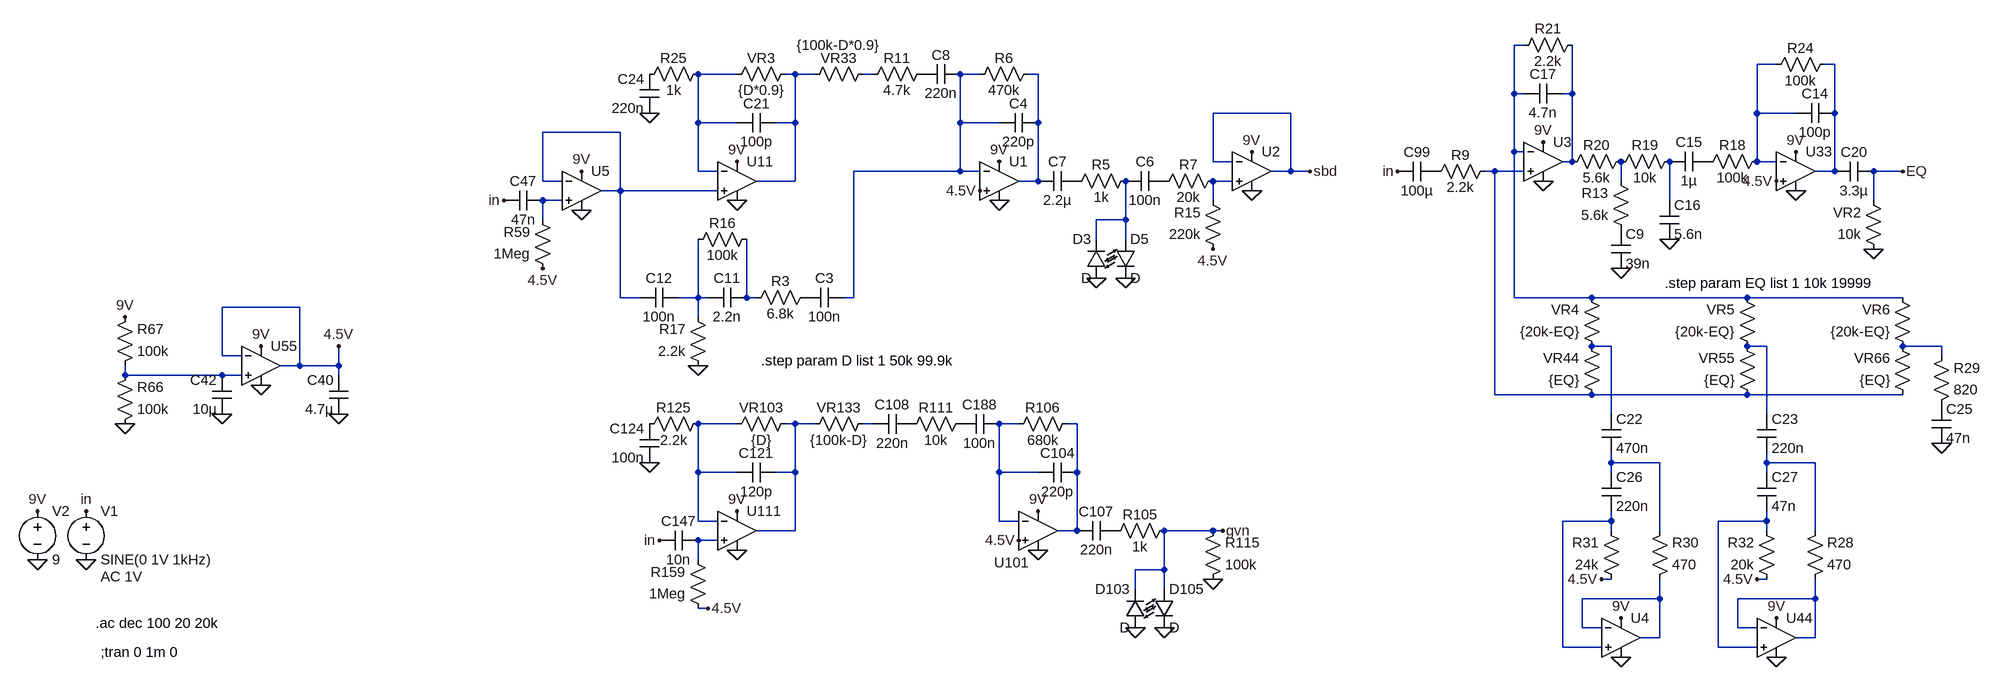
[diagram p0: schematic SuperBadassDist.asc]
SuperBadassDist.asc, the LTspice schematic file:
Version 4
SHEET 1 3148 2436
WIRE -80 0 -96 0
WIRE 336 32 304 32
WIRE 432 32 416 32
WIRE -1376 48 -1440 48
WIRE -1280 48 -1296 48
WIRE -1248 48 -1280 48
WIRE -1152 48 -1168 48
WIRE -976 48 -1008 48
WIRE -880 48 -896 48
WIRE -96 80 -96 0
WIRE -80 80 -96 80
WIRE 0 80 0 0
WIRE 0 80 -16 80
WIRE -464 112 -592 112
WIRE 304 112 304 32
WIRE 368 112 304 112
WIRE 432 112 432 32
WIRE -1440 128 -1440 48
WIRE -1376 128 -1440 128
WIRE -1280 128 -1280 48
WIRE -1280 128 -1312 128
WIRE -1008 128 -1008 48
WIRE -944 128 -1008 128
WIRE -880 128 -880 48
WIRE -1568 144 -1696 144
WIRE -96 176 -96 80
WIRE -80 176 -96 176
WIRE -592 192 -592 112
WIRE -560 192 -592 192
WIRE 0 192 0 80
WIRE 0 192 -16 192
WIRE 304 192 304 112
WIRE 336 192 304 192
WIRE -1440 208 -1440 128
WIRE -1408 208 -1440 208
WIRE -1008 208 -1008 128
WIRE -1008 208 -1184 208
WIRE -976 208 -1008 208
WIRE -464 208 -464 112
WIRE -464 208 -496 208
WIRE -432 208 -464 208
WIRE -128 208 -144 208
WIRE -80 208 -128 208
WIRE 432 208 432 112
WIRE 432 208 400 208
WIRE 544 208 496 208
WIRE -1696 224 -1696 144
WIRE -1664 224 -1696 224
WIRE -1280 224 -1280 128
WIRE -1280 224 -1344 224
WIRE -880 224 -880 128
WIRE -880 224 -912 224
WIRE -560 224 -592 224
WIRE 80 224 80 192
WIRE -1568 240 -1568 144
WIRE -1568 240 -1600 240
WIRE -1408 240 -1568 240
WIRE -1664 256 -1696 256
WIRE -592 256 -592 224
WIRE 160 256 160 192
WIRE 496 256 496 208
WIRE -1696 288 -1696 256
WIRE -736 288 -736 224
WIRE -736 288 -784 288
WIRE -784 320 -784 288
WIRE -736 320 -736 288
WIRE -1568 416 -1568 240
WIRE -1536 416 -1568 416
WIRE -1440 416 -1440 320
WIRE -1440 416 -1472 416
WIRE -1424 416 -1440 416
WIRE -1360 416 -1360 320
WIRE -1344 416 -1360 416
WIRE -1184 416 -1184 208
WIRE -1184 416 -1200 416
WIRE -96 416 -96 176
WIRE 32 416 -96 416
WIRE 288 416 32 416
WIRE 544 416 288 416
WIRE -2096 432 -2224 432
WIRE -1440 448 -1440 416
WIRE 64 496 32 496
WIRE 320 496 288 496
WIRE 608 496 544 496
WIRE -2224 512 -2224 432
WIRE -2192 512 -2224 512
WIRE 608 512 608 496
WIRE -2096 528 -2096 432
WIRE -2096 528 -2128 528
WIRE -2032 528 -2032 496
WIRE -2032 528 -2096 528
WIRE -2384 544 -2384 528
WIRE -2224 544 -2384 544
WIRE -2192 544 -2224 544
WIRE -2032 544 -2032 528
WIRE -128 576 -128 208
WIRE 32 576 -128 576
WIRE 288 576 32 576
WIRE 544 576 288 576
WIRE 64 608 64 496
WIRE 320 608 320 496
WIRE -1376 624 -1440 624
WIRE -1280 624 -1296 624
WIRE -1248 624 -1280 624
WIRE -1152 624 -1168 624
WIRE -912 624 -944 624
WIRE -816 624 -832 624
WIRE 64 688 64 672
WIRE 144 688 64 688
WIRE 320 688 320 672
WIRE 400 688 320 688
WIRE -1440 704 -1440 624
WIRE -1376 704 -1440 704
WIRE -1280 704 -1280 624
WIRE -1280 704 -1312 704
WIRE -944 704 -944 624
WIRE -880 704 -944 704
WIRE -816 704 -816 624
WIRE 64 704 64 688
WIRE 320 704 320 688
WIRE -1440 784 -1440 704
WIRE -1408 784 -1440 784
WIRE -944 784 -944 704
WIRE -912 784 -944 784
WIRE 64 784 64 768
WIRE 64 784 -16 784
WIRE 320 784 320 768
WIRE 320 784 240 784
WIRE -1280 800 -1280 704
WIRE -1280 800 -1344 800
WIRE -816 800 -816 704
WIRE -816 800 -848 800
WIRE -592 800 -672 800
WIRE -576 800 -592 800
WIRE 64 800 64 784
WIRE 144 800 144 688
WIRE 320 800 320 784
WIRE 400 800 400 688
WIRE -1408 816 -1440 816
WIRE -1440 848 -1440 816
WIRE -672 864 -672 800
WIRE -672 864 -720 864
WIRE 64 880 48 880
WIRE 320 880 304 880
WIRE -720 896 -720 864
WIRE -672 896 -672 864
WIRE 144 912 144 880
WIRE 144 912 16 912
WIRE 400 912 400 880
WIRE 400 912 272 912
WIRE -1424 928 -1440 928
WIRE 16 960 16 912
WIRE 48 960 16 960
WIRE 272 960 272 912
WIRE 304 960 272 960
WIRE 144 976 144 912
WIRE 144 976 112 976
WIRE 400 976 400 912
WIRE 400 976 368 976
WIRE -16 992 -16 784
WIRE 48 992 -16 992
WIRE 240 992 240 784
WIRE 304 992 240 992
FLAG -2448 848 0
FLAG -2448 768 in
FLAG -432 208 sbd
FLAG -2384 448 9V
FLAG -2384 624 0
FLAG -2224 608 0
FLAG -2160 560 0
FLAG -2160 496 9V
FLAG -2032 608 0
FLAG -2032 496 4.5V
FLAG -2528 848 0
FLAG -2528 768 9V
FLAG -1632 272 0
FLAG -1632 208 9V
FLAG -1696 368 4.5V
FLAG -1760 256 in
FLAG -1376 256 0
FLAG -1376 192 9V
FLAG -944 256 0
FLAG -944 192 9V
FLAG -1520 112 0
FLAG -976 240 4.5V
FLAG -1440 528 0
FLAG -784 384 0
FLAG -736 384 0
FLAG -592 336 4.5V
FLAG -528 240 0
FLAG -528 176 9V
FLAG -48 224 0
FLAG -48 160 9V
FLAG 80 1008 0
FLAG 80 944 9V
FLAG 80 368 0
FLAG 160 320 0
FLAG 368 240 0
FLAG 368 176 9V
FLAG 336 224 4.5V
FLAG 496 336 0
FLAG 48 880 4.5V
FLAG 336 1008 0
FLAG 336 944 9V
FLAG 304 880 4.5V
FLAG 608 656 0
FLAG 544 208 EQ
FLAG -288 208 in
FLAG -1424 928 4.5V
FLAG -1504 816 in
FLAG -1376 832 0
FLAG -1376 768 9V
FLAG -880 832 0
FLAG -880 768 9V
FLAG -1520 688 0
FLAG -912 816 4.5V
FLAG -576 800 gvn
FLAG -720 960 0
FLAG -672 960 0
FLAG -592 880 0
SYMBOL voltage -2448 752 R0
WINDOW 123 24 124 Left 2
WINDOW 39 0 0 Left 2
SYMATTR Value2 AC 1V
SYMATTR InstName V1
SYMATTR Value SINE(0 1V 1kHz)
SYMBOL res -2400 544 M180
WINDOW 0 36 76 Left 2
WINDOW 3 36 40 Left 2
SYMATTR InstName R67
SYMATTR Value 100k
SYMBOL res -2400 640 M180
WINDOW 0 36 76 Left 2
WINDOW 3 36 40 Left 2
SYMATTR InstName R66
SYMATTR Value 100k
SYMBOL cap -2208 608 R180
WINDOW 0 24 56 Left 2
WINDOW 3 24 8 Left 2
SYMATTR InstName C42
SYMATTR Value 10µ
SYMBOL Opamps\\UniversalOpamp2 -2160 528 R0
SYMATTR InstName U55
SYMBOL cap -2016 608 R180
WINDOW 0 24 56 Left 2
WINDOW 3 24 8 Left 2
SYMATTR InstName C40
SYMATTR Value 4.7µ
SYMBOL voltage -2528 752 R0
WINDOW 123 0 0 Left 0
WINDOW 39 0 0 Left 0
SYMATTR InstName V2
SYMATTR Value 9
SYMBOL Opamps\\UniversalOpamp2 -1632 240 R0
SYMATTR InstName U5
SYMBOL res -1680 384 R180
WINDOW 0 36 76 Left 2
WINDOW 3 36 40 Left 2
SYMATTR InstName R59
SYMATTR Value 1Meg
SYMBOL cap -1696 240 R90
WINDOW 0 0 32 VBottom 2
WINDOW 3 32 32 VTop 2
SYMATTR InstName C47
SYMATTR Value 47n
SYMBOL Opamps\\UniversalOpamp2 -1376 224 R0
SYMATTR InstName U11
SYMBOL cap -1472 400 R90
WINDOW 0 0 32 VBottom 2
WINDOW 3 32 32 VTop 2
SYMATTR InstName C12
SYMATTR Value 100n
SYMBOL res -1344 304 R90
WINDOW 0 5 56 VBottom 2
WINDOW 3 27 56 VTop 2
SYMATTR InstName R16
SYMATTR Value 100k
SYMBOL cap -1360 400 R90
WINDOW 0 0 32 VBottom 2
WINDOW 3 32 32 VTop 2
SYMATTR InstName C11
SYMATTR Value 2.2n
SYMBOL res -1424 544 R180
WINDOW 0 36 76 Left 2
WINDOW 3 36 40 Left 2
SYMATTR InstName R17
SYMATTR Value 2.2k
SYMBOL res -1248 400 R90
WINDOW 0 5 56 VBottom 2
WINDOW 3 27 56 VTop 2
SYMATTR InstName R3
SYMATTR Value 6.8k
SYMBOL cap -1200 400 R90
WINDOW 0 0 32 VBottom 2
WINDOW 3 32 32 VTop 2
SYMATTR InstName C3
SYMATTR Value 100n
SYMBOL Opamps\\UniversalOpamp2 -944 224 R0
SYMATTR InstName U1
SYMBOL cap -1312 112 R90
WINDOW 0 0 32 VBottom 2
WINDOW 3 32 32 VTop 2
SYMATTR InstName C21
SYMATTR Value 100p
SYMBOL res -1280 32 R90
WINDOW 0 5 56 VBottom 2
WINDOW 3 27 56 VTop 2
SYMATTR InstName VR3
SYMATTR Value {D*0.9}
SYMBOL res -1424 32 R90
WINDOW 0 5 56 VBottom 2
WINDOW 3 27 56 VTop 2
SYMATTR InstName R25
SYMATTR Value 1k
SYMBOL cap -1504 112 R180
WINDOW 0 24 56 Left 2
WINDOW 3 24 8 Left 2
SYMATTR InstName C24
SYMATTR Value 220n
SYMBOL res -1152 32 R90
WINDOW 0 5 56 VBottom 2
WINDOW 3 -47 57 VTop 2
SYMATTR InstName VR33
SYMATTR Value {100k-D*0.9}
SYMBOL res -1056 32 R90
WINDOW 0 5 56 VBottom 2
WINDOW 3 27 56 VTop 2
SYMATTR InstName R11
SYMATTR Value 4.7k
SYMBOL cap -1008 32 R90
WINDOW 0 0 32 VBottom 2
WINDOW 3 32 32 VTop 2
SYMATTR InstName C8
SYMATTR Value 220n
SYMBOL res -880 32 R90
WINDOW 0 5 56 VBottom 2
WINDOW 3 27 56 VTop 2
SYMATTR InstName R6
SYMATTR Value 470k
SYMBOL cap -880 112 R90
WINDOW 0 0 32 VBottom 2
WINDOW 3 32 32 VTop 2
SYMATTR InstName C4
SYMATTR Value 220p
SYMBOL cap -816 208 R90
WINDOW 0 0 32 VBottom 2
WINDOW 3 32 32 VTop 2
SYMATTR InstName C7
SYMATTR Value 2.2µ
SYMBOL res -720 208 R90
WINDOW 0 5 56 VBottom 2
WINDOW 3 27 56 VTop 2
SYMATTR InstName R5
SYMATTR Value 1k
SYMBOL LED -752 320 R0
SYMATTR InstName D5
SYMBOL LED -768 384 R180
WINDOW 0 24 64 Left 2
WINDOW 3 24 0 Left 2
SYMATTR InstName D3
SYMBOL cap -672 208 R90
WINDOW 0 0 32 VBottom 2
WINDOW 3 32 32 VTop 2
SYMATTR InstName C6
SYMATTR Value 100n
SYMBOL res -576 208 R90
WINDOW 0 5 56 VBottom 2
WINDOW 3 27 56 VTop 2
SYMATTR InstName R7
SYMATTR Value 20k
SYMBOL res -576 352 R180
WINDOW 0 36 76 Left 2
WINDOW 3 36 40 Left 2
SYMATTR InstName R15
SYMATTR Value 220k
SYMBOL Opamps\\UniversalOpamp2 -528 208 R0
SYMATTR InstName U2
SYMBOL cap -224 192 R90
WINDOW 0 0 32 VBottom 2
WINDOW 3 32 32 VTop 2
SYMATTR InstName C99
SYMATTR Value 100µ
SYMBOL res -128 192 R90
WINDOW 0 5 56 VBottom 2
WINDOW 3 27 56 VTop 2
SYMATTR InstName R9
SYMATTR Value 2.2k
SYMBOL Opamps\\UniversalOpamp2 -48 192 R0
SYMATTR InstName U3
SYMBOL res 16 -16 R90
WINDOW 0 5 56 VBottom 2
WINDOW 3 27 56 VTop 2
SYMATTR InstName R21
SYMATTR Value 2.2k
SYMBOL cap -16 64 R90
WINDOW 0 0 32 VBottom 2
WINDOW 3 32 32 VTop 2
SYMATTR InstName C17
SYMATTR Value 4.7n
SYMBOL Opamps\\UniversalOpamp2 80 976 R0
SYMATTR InstName U4
SYMBOL res 96 176 R90
WINDOW 0 5 56 VBottom 2
WINDOW 3 27 56 VTop 2
SYMATTR InstName R20
SYMATTR Value 5.6k
SYMBOL res 96 320 R180
WINDOW 0 36 76 Left 2
WINDOW 3 36 40 Left 2
SYMATTR InstName R13
SYMATTR Value 5.6k
SYMBOL cap 64 304 R0
SYMATTR InstName C9
SYMATTR Value 39n
SYMBOL res 176 176 R90
WINDOW 0 5 56 VBottom 2
WINDOW 3 27 56 VTop 2
SYMATTR InstName R19
SYMATTR Value 10k
SYMBOL cap 144 256 R0
SYMATTR InstName C16
SYMATTR Value 5.6n
SYMBOL res 320 176 R90
WINDOW 0 5 56 VBottom 2
WINDOW 3 27 56 VTop 2
SYMATTR InstName R18
SYMATTR Value 100k
SYMBOL Opamps\\UniversalOpamp2 368 208 R0
SYMATTR InstName U33
SYMBOL res 432 16 R90
WINDOW 0 5 56 VBottom 2
WINDOW 3 27 56 VTop 2
SYMATTR InstName R24
SYMATTR Value 100k
SYMBOL cap 432 96 R90
WINDOW 0 0 32 VBottom 2
WINDOW 3 32 32 VTop 2
SYMATTR InstName C14
SYMATTR Value 100p
SYMBOL cap 496 192 R90
WINDOW 0 0 32 VBottom 2
WINDOW 3 32 32 VTop 2
SYMATTR InstName C20
SYMATTR Value 3.3µ
SYMBOL res 512 352 R180
WINDOW 0 36 76 Left 2
WINDOW 3 36 40 Left 2
SYMATTR InstName VR2
SYMATTR Value 10k
SYMBOL res 48 592 R180
WINDOW 0 36 76 Left 2
WINDOW 3 36 40 Left 2
SYMATTR InstName VR44
SYMATTR Value {EQ}
SYMBOL res 560 512 R180
WINDOW 0 36 76 Left 2
WINDOW 3 36 40 Left 2
SYMATTR InstName VR6
SYMATTR Value {20k-EQ}
SYMBOL cap 48 608 R0
SYMATTR InstName C22
SYMATTR Value 470n
SYMBOL cap 48 704 R0
SYMATTR InstName C26
SYMATTR Value 220n
SYMBOL res 80 896 R180
WINDOW 0 36 76 Left 2
WINDOW 3 36 40 Left 2
SYMATTR InstName R31
SYMATTR Value 24k
SYMBOL res 128 896 M180
WINDOW 0 36 76 Left 2
WINDOW 3 36 40 Left 2
SYMATTR InstName R30
SYMATTR Value 470
SYMBOL Opamps\\UniversalOpamp2 336 976 R0
SYMATTR InstName U44
SYMBOL res 304 592 R180
WINDOW 0 36 76 Left 2
WINDOW 3 36 40 Left 2
SYMATTR InstName VR55
SYMATTR Value {EQ}
SYMBOL res 48 512 R180
WINDOW 0 36 76 Left 2
WINDOW 3 36 40 Left 2
SYMATTR InstName VR4
SYMATTR Value {20k-EQ}
SYMBOL cap 304 608 R0
SYMATTR InstName C23
SYMATTR Value 220n
SYMBOL cap 304 704 R0
SYMATTR InstName C27
SYMATTR Value 47n
SYMBOL res 336 896 R180
WINDOW 0 36 76 Left 2
WINDOW 3 36 40 Left 2
SYMATTR InstName R32
SYMATTR Value 20k
SYMBOL res 384 896 M180
WINDOW 0 36 76 Left 2
WINDOW 3 36 40 Left 2
SYMATTR InstName R28
SYMATTR Value 470
SYMBOL res 560 592 R180
WINDOW 0 36 76 Left 2
WINDOW 3 36 40 Left 2
SYMATTR InstName VR66
SYMATTR Value {EQ}
SYMBOL res 304 512 R180
WINDOW 0 36 76 Left 2
WINDOW 3 36 40 Left 2
SYMATTR InstName VR5
SYMATTR Value {20k-EQ}
SYMBOL res 592 608 M180
WINDOW 0 36 76 Left 2
WINDOW 3 36 40 Left 2
SYMATTR InstName R29
SYMATTR Value 820
SYMBOL cap 592 592 R0
SYMATTR InstName C25
SYMATTR Value 47n
SYMBOL cap 224 176 R90
WINDOW 0 0 32 VBottom 2
WINDOW 3 32 32 VTop 2
SYMATTR InstName C15
SYMATTR Value 1µ
SYMBOL res -1424 944 R180
WINDOW 0 36 76 Left 2
WINDOW 3 36 40 Left 2
SYMATTR InstName R159
SYMATTR Value 1Meg
SYMBOL cap -1440 800 R90
WINDOW 0 0 32 VBottom 2
WINDOW 3 32 32 VTop 2
SYMATTR InstName C147
SYMATTR Value 10n
SYMBOL Opamps\\UniversalOpamp2 -1376 800 R0
SYMATTR InstName U111
SYMBOL Opamps\\UniversalOpamp2 -880 800 R0
WINDOW 0 -72 53 Left 2
SYMATTR InstName U101
SYMBOL cap -1312 688 R90
WINDOW 0 0 32 VBottom 2
WINDOW 3 32 32 VTop 2
SYMATTR InstName C121
SYMATTR Value 120p
SYMBOL res -1280 608 R90
WINDOW 0 5 56 VBottom 2
WINDOW 3 27 56 VTop 2
SYMATTR InstName VR103
SYMATTR Value {D}
SYMBOL res -1424 608 R90
WINDOW 0 5 56 VBottom 2
WINDOW 3 27 56 VTop 2
SYMATTR InstName R125
SYMATTR Value 2.2k
SYMBOL cap -1504 688 R180
WINDOW 0 24 56 Left 2
WINDOW 3 24 8 Left 2
SYMATTR InstName C124
SYMATTR Value 100n
SYMBOL res -1152 608 R90
WINDOW 0 5 56 VBottom 2
WINDOW 3 27 56 VTop 2
SYMATTR InstName VR133
SYMATTR Value {100k-D}
SYMBOL res -992 608 R90
WINDOW 0 5 56 VBottom 2
WINDOW 3 27 56 VTop 2
SYMATTR InstName R111
SYMATTR Value 10k
SYMBOL cap -944 608 R90
WINDOW 0 0 32 VBottom 2
WINDOW 3 32 32 VTop 2
SYMATTR InstName C188
SYMATTR Value 100n
SYMBOL res -816 608 R90
WINDOW 0 5 56 VBottom 2
WINDOW 3 27 56 VTop 2
SYMATTR InstName R106
SYMATTR Value 680k
SYMBOL cap -816 688 R90
WINDOW 0 0 32 VBottom 2
WINDOW 3 32 32 VTop 2
SYMATTR InstName C104
SYMATTR Value 220p
SYMBOL cap -1088 608 R90
WINDOW 0 0 32 VBottom 2
WINDOW 3 32 32 VTop 2
SYMATTR InstName C108
SYMATTR Value 220n
SYMBOL cap -752 784 R90
WINDOW 0 0 32 VBottom 2
WINDOW 3 32 32 VTop 2
SYMATTR InstName C107
SYMATTR Value 220n
SYMBOL res -656 784 R90
WINDOW 0 5 56 VBottom 2
WINDOW 3 27 56 VTop 2
SYMATTR InstName R105
SYMATTR Value 1k
SYMBOL LED -688 896 R0
SYMATTR InstName D105
SYMBOL LED -704 960 R180
WINDOW 0 24 64 Left 2
WINDOW 3 24 0 Left 2
SYMATTR InstName D103
SYMBOL res -608 896 M180
WINDOW 0 36 76 Left 2
WINDOW 3 36 40 Left 2
SYMATTR InstName R115
SYMATTR Value 100k
TEXT -2432 952 Left 2 !.ac dec 100 20 20k
TEXT -2424 1000 Left 2 !;tran 0 1m 0
TEXT 152 392 Left 2 !.step param EQ list 1 10k 19999
TEXT -1336 520 Left 2 !.step param D list 1 50k 99.9k

The netlist it stands for:
* SuperBadassDist.asc
V1 in 0 SINE(0 1V 1kHz) AC 1V
R67 N022 9V 100k
R66 0 N022 100k
C42 0 N022 10µ
XU55 N022 4.5V 9V 0 4.5V level.2 Avol=1Meg GBW=10Meg Slew=10Meg ilimit=25m rail=0 Vos=0 phimargin=45 en=0 enk=0 in=0 ink=0 Rin=500Meg  ; pins IN+ IN- V+ V- OUT
C40 0 4.5V 4.7µ
V2 9V 0 9
XU5 N014 N010 9V 0 N010 level.2 Avol=1Meg GBW=10Meg Slew=10Meg ilimit=25m rail=0 Vos=0 phimargin=45 en=0 enk=0 in=0 ink=0 Rin=500Meg  ; pins IN+ IN- V+ V- OUT
R59 4.5V N014 1Meg
C47 N014 in 47n
XU11 N010 N004 9V 0 N005 level.2 Avol=1Meg GBW=10Meg Slew=10Meg ilimit=25m rail=0 Vos=0 phimargin=45 en=0 enk=0 in=0 ink=0 Rin=500Meg  ; pins IN+ IN- V+ V- OUT
C12 N017 N010 100n
R16 N018 N017 100k
C11 N018 N017 2.2n
R17 0 N017 2.2k
R3 P001 N018 6.8k
C3 N007 P001 100n
XU1 4.5V N007 9V 0 N008 level.2 Avol=1Meg GBW=10Meg Slew=10Meg ilimit=25m rail=0 Vos=0 phimargin=45 en=0 enk=0 in=0 ink=0 Rin=500Meg  ; pins IN+ IN- V+ V- OUT
C21 N005 N004 100p
R§VR3 N005 N004 {D*0.9}
R25 N004 P002 1k
C24 0 P002 220n
R§VR33 N006 N005 {100k-D*0.9}
R11 P003 N006 4.7k
C8 N007 P003 220n
R6 N008 N007 470k
C4 N008 N007 220p
C7 P004 N008 2.2µ
R5 N016 P004 1k
D5 N016 0 D
D3 0 N016 D
C6 P005 N016 100n
R7 N012 P005 20k
R15 4.5V N012 220k
XU2 N012 sbd 9V 0 sbd level.2 Avol=1Meg GBW=10Meg Slew=10Meg ilimit=25m rail=0 Vos=0 phimargin=45 en=0 enk=0 in=0 ink=0 Rin=500Meg  ; pins IN+ IN- V+ V- OUT
C99 P006 in 100µ
R9 N011 P006 2.2k
XU3 N011 N001 9V 0 N009 level.2 Avol=1Meg GBW=10Meg Slew=10Meg ilimit=25m rail=0 Vos=0 phimargin=45 en=0 enk=0 in=0 ink=0 Rin=500Meg  ; pins IN+ IN- V+ V- OUT
R21 N009 N001 2.2k
C17 N009 N001 4.7n
XU4 N030 N033 9V 0 N033 level.2 Avol=1Meg GBW=10Meg Slew=10Meg ilimit=25m rail=0 Vos=0 phimargin=45 en=0 enk=0 in=0 ink=0 Rin=500Meg  ; pins IN+ IN- V+ V- OUT
R20 N013 N009 5.6k
R13 P007 N013 5.6k
C9 P007 0 39n
R19 N015 N013 10k
C16 N015 0 5.6n
R18 N002 P008 100k
XU33 4.5V N002 9V 0 N003 level.2 Avol=1Meg GBW=10Meg Slew=10Meg ilimit=25m rail=0 Vos=0 phimargin=45 en=0 enk=0 in=0 ink=0 Rin=500Meg  ; pins IN+ IN- V+ V- OUT
R24 N003 N002 100k
C14 N003 N002 100p
C20 EQ N003 3.3µ
R§VR2 0 EQ 10k
R§VR44 N011 N019 {EQ}
R§VR6 N021 N001 {20k-EQ}
C22 N019 N028 470n
C26 N028 N030 220n
R31 4.5V N030 24k
R30 N033 N028 470
XU44 N031 N034 9V 0 N034 level.2 Avol=1Meg GBW=10Meg Slew=10Meg ilimit=25m rail=0 Vos=0 phimargin=45 en=0 enk=0 in=0 ink=0 Rin=500Meg  ; pins IN+ IN- V+ V- OUT
R§VR55 N011 N020 {EQ}
R§VR4 N019 N001 {20k-EQ}
C23 N020 N029 220n
C27 N029 N031 47n
R32 4.5V N031 20k
R28 N034 N029 470
R§VR66 N011 N021 {EQ}
R§VR5 N020 N001 {20k-EQ}
R29 P009 N021 820
C25 P009 0 47n
C15 P008 N015 1µ
R159 4.5V N032 1Meg
C147 N032 in 10n
XU111 N032 N023 9V 0 N024 level.2 Avol=1Meg GBW=10Meg Slew=10Meg ilimit=25m rail=0 Vos=0 phimargin=45 en=0 enk=0 in=0 ink=0 Rin=500Meg  ; pins IN+ IN- V+ V- OUT
XU101 4.5V N026 9V 0 N027 level.2 Avol=1Meg GBW=10Meg Slew=10Meg ilimit=25m rail=0 Vos=0 phimargin=45 en=0 enk=0 in=0 ink=0 Rin=500Meg  ; pins IN+ IN- V+ V- OUT
C121 N024 N023 120p
R§VR103 N024 N023 {D}
R125 N023 P010 2.2k
C124 0 P010 100n
R§VR133 N025 N024 {100k-D}
R111 P011 P012 10k
C188 N026 P011 100n
R106 N027 N026 680k
C104 N027 N026 220p
C108 P012 N025 220n
C107 P013 N027 220n
R105 gvn P013 1k
D105 gvn 0 D
D103 0 gvn D
R115 0 gvn 100k
.model D D
.lib standard.dio
.ac dec 100 20 20k
;tran 0 1m 0
.step param EQ list 1 10k 19999
.step param D list 1 50k 99.9k
.lib UniversalOpamps2.sub
.backanno
.end